# EAGLE design RaspberryPi_Connections (EAGLE 9.2.1)
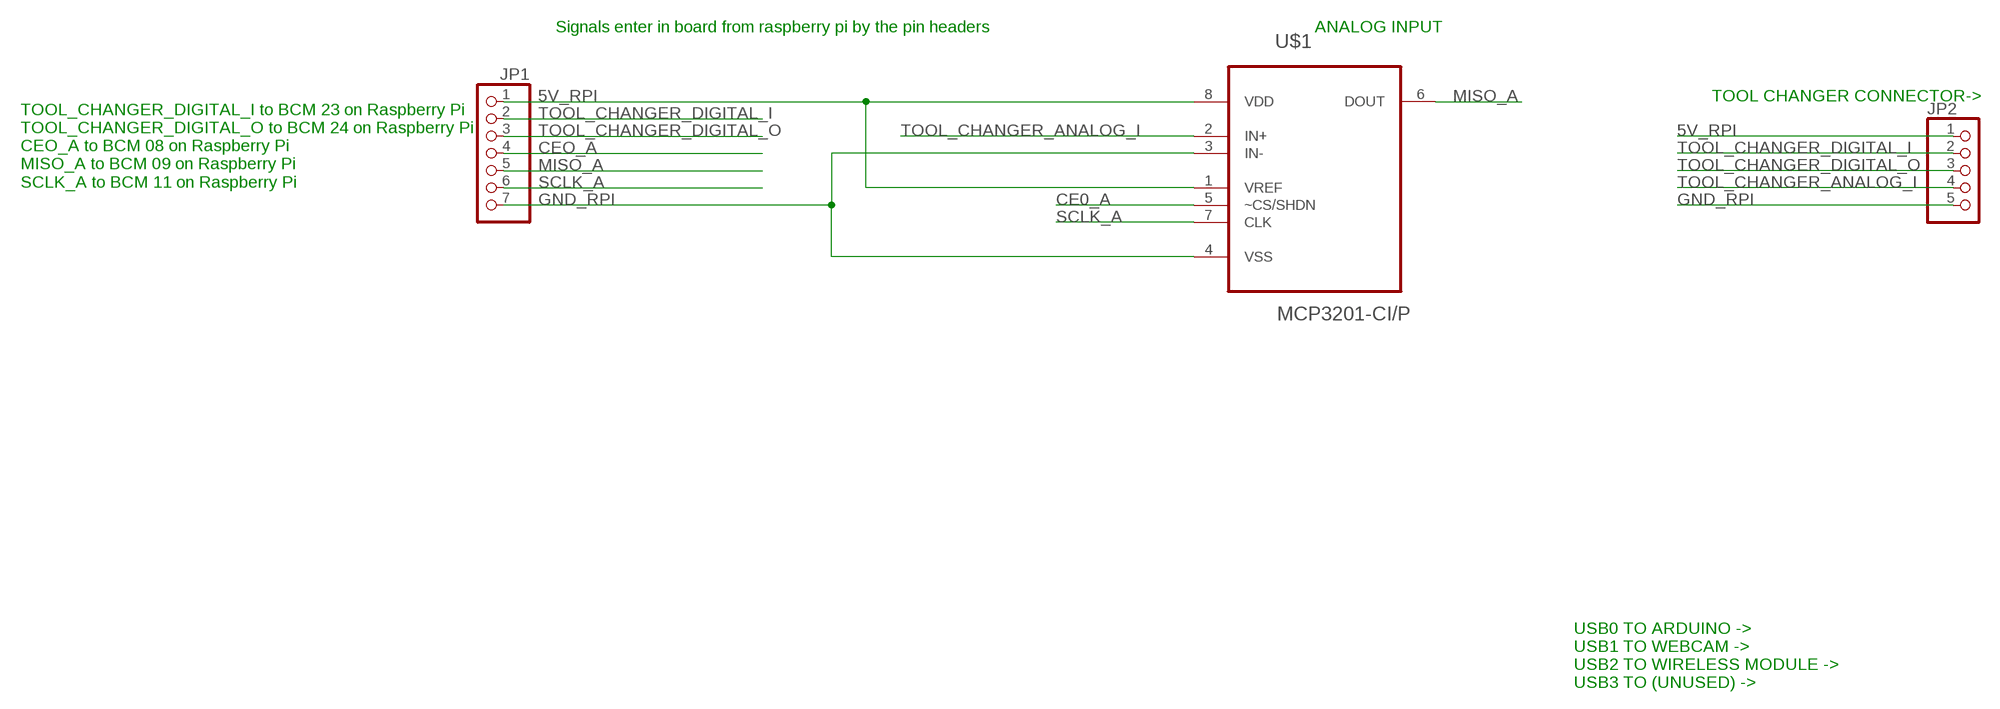
[diagram p0: schematic, sheet 1]

## Parts
JP1  PINHD-1X7  [1X07]
JP2  PINHD-1X5  [1X05]
U$1  MCP3201-CI/P  [DIP254P762X533-8]

## Nets
5V_RPI: JP1.1 JP2.1 U$1.1(VREF) U$1.8(VDD)
CE0_A: U$1.5(~CS/SHDN)
CEO_A: JP1.4
GND_RPI: JP1.7 JP2.5 U$1.3(IN-) U$1.4(VSS)
MISO_A: JP1.5 U$1.6(DOUT)
SCLK_A: JP1.6 U$1.7(CLK)
TOOL_CHANGER_ANALOG_I: JP2.4 U$1.2(IN+)
TOOL_CHANGER_DIGITAL_I: JP1.2 JP2.2
TOOL_CHANGER_DIGITAL_O: JP1.3 JP2.3

## Notes on the sheet
- Signals enter in board from raspberry pi by the pin headers | ANALOG INPUT
- TOOL CHANGER CONNECTOR->
- TOOL_CHANGER_DIGITAL_I to BCM 23 on Raspberry Pi
  TOOL_CHANGER_DIGITAL_O to BCM 24 on Raspberry Pi
  CEO_A to BCM 08 on Raspberry Pi
  MISO_A to BCM 09 on Raspberry Pi
  SCLK_A to BCM 11 on Raspberry Pi
- USB0 TO ARDUINO ->
  USB1 TO WEBCAM ->
  USB2 TO WIRELESS MODULE ->
  USB3 TO (UNUSED) ->

## Library data of the parts
JP1 = pinhead:PINHD-1X7: PIN HEADER
JP2 = pinhead:PINHD-1X5: PIN HEADER
U$1 = MCP3201-CI_P:MCP3201-CI/P: A/D Converter; AVAILABILITY: Unavailable; DESCRIPTION: Single Channel SPI Serial Interface 2.7 V 12-Bit A/D Converter - PDIP-8; MF: Microchip; MP: MCP3201-CI/P; PACKAGE: DIP-8 Microchip; PRICE: None

## Board
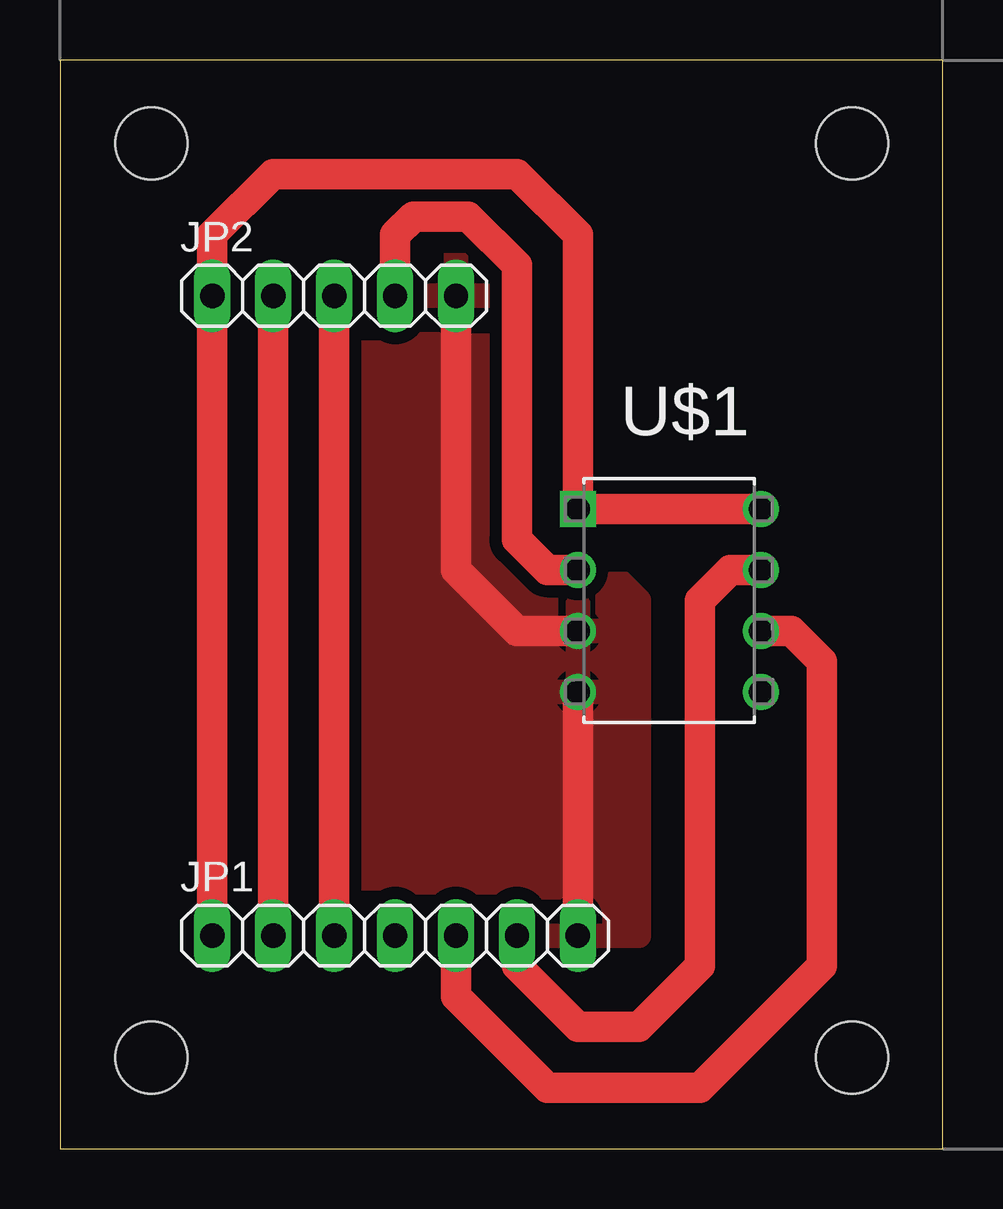
[diagram p1: board, top side]

Size 36.81 x 45.39 mm. Coordinates in mm from the lower left corner, seen from the top.
Outline: 0,0 36.81,0 36.81,45.39 0,45.39 0,0
Copper layers (1*16): Top 0.035mm / dielectric 1.5mm / Bottom 0.035mm
Design rules "default *": minimum track width 20mil, minimum drill 0.35mm, track to track 20mil, track to pad 20mil, pad to pad 20mil, via to via 20mil, smd to smd 6mil, copper to edge 20mil, drill to drill 20mil, minimum pad ring 10mil, minimum via ring 8mil, stop-mask expansion 4mil, vias tented up to drill 0mil, thermal gap 10mil
Holes 3 mm at 3.81,41.91 3.81,3.81 33.02,3.81 33.02,41.91

### Footprints (pad centres in the part's own frame; a part is rotated, then mirrored left to right if it is on the bottom)
1X07 = drill 1.016 long: 1 -7.62,0; 2 -5.08,0; 3 -2.54,0; 4 0,0; 5 2.54,0; 6 5.08,0; 7 7.62,0
1X05 = drill 1.016 long: 1 -5.08,0; 2 -2.54,0; 3 0,0; 4 2.54,0; 5 5.08,0
DIP254P762X533-8 = drill 0.991 square: 1 -7.62,7.62 | drill 0.991: 2 -7.62,5.08; 3 -7.62,2.54; 4 -7.62,0; 5 0,0; 6 0,2.54; 7 0,5.08; 8 0,7.62

### Placement (x,y rotation side)
JP1  13.97,8.89 0 top
JP2  11.43,35.56 0 top
U$1  29.21,19.05 0 top

### Tracks (layer width: path | path; a pad name or v marks a point on that pad's centre or on a via)
5V_RPI
  Top 1.27: JP1.1 JP2.1 6.35,38.1 8.89,40.64 19.05,40.64 21.59,38.1 U$1.1 U$1.8
GND_RPI
  Top 1.27: JP1.7 U$1.4 | JP2.5 16.51,24.13 19.05,21.59 U$1.3
  pour Top: 11.43,36.83 11.43,8.89 24.13,8.89 24.13,22.86 22.86,24.13 19.05,27.94 19.05,36.83
MISO_A
  Top 1.27: U$1.6 30.48,21.59 31.75,20.32 31.75,7.62 26.67,2.54 20.32,2.54 16.51,6.35 JP1.5
SCLK_A
  Top 1.27: JP1.6 19.05,7.62 21.59,5.08 24.13,5.08 26.67,7.62 26.67,22.86 27.94,24.13 U$1.7
TOOL_CHANGER_ANALOG_I
  Top 1.27: JP2.4 13.97,38.1 14.73,38.86 17.02,38.86 19.05,36.83 19.05,25.4 20.32,24.13 U$1.2
TOOL_CHANGER_DIGITAL_I
  Top 1.27: JP1.2 JP2.2
TOOL_CHANGER_DIGITAL_O
  Top 1.27: JP1.3 JP2.3